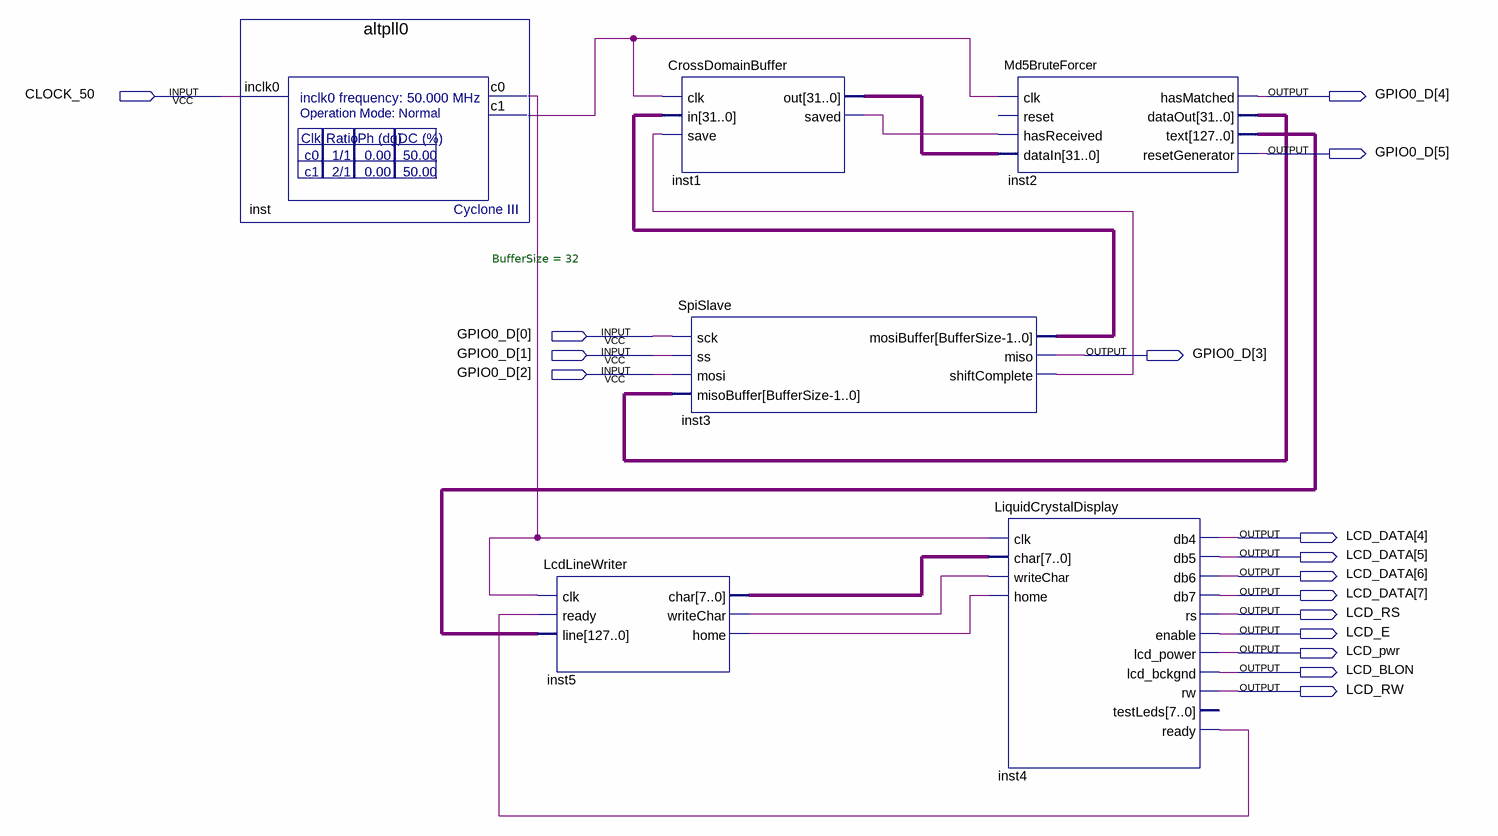
[diagram p0: schematic sheet]
// Quartus schematic DE0_fpga_md5.bdf as structural Verilog: 6 symbols, 16 pins
module DE0_fpga_md5 (
  input  CLOCK_50,
  inout  [5:0] GPIO0_D,
  output [7:4] LCD_DATA,
  output LCD_RS,
  output LCD_E,
  output LCD_pwr,
  output LCD_BLON,
  output LCD_RW
);

  wire inst1_saved, inst3_shiftcomplete, inst4_ready, inst5_home, inst5_writechar, inst_c0, inst_c1;
  wire [7:0] inst5_char;
  wire [31:0] inst1_out, inst2_dataout, inst3_mosibuffer;
  wire [127:0] inst2_text;

  altpll0 inst (.inclk0(CLOCK_50), .c0(inst_c0), .c1(inst_c1));
  LcdLineWriter inst5 (
    .clk(inst_c0), .ready(inst4_ready), .line(inst2_text), .char(inst5_char), .writeChar(inst5_writechar),
    .home(inst5_home));
  CrossDomainBuffer inst1 (
    .clk(inst_c1), .in(inst3_mosibuffer), .save(inst3_shiftcomplete), .out(inst1_out), .saved(inst1_saved));
  SpiSlave #(.BufferSize(32)) inst3 (
    .sck(GPIO0_D[0]), .ss(GPIO0_D[1]), .mosi(GPIO0_D[2]), .misoBuffer(inst2_dataout),
    .mosiBuffer(inst3_mosibuffer), .miso(GPIO0_D[3]), .shiftComplete(inst3_shiftcomplete));
  Md5BruteForcer inst2 (
    .clk(inst_c1), .hasReceived(inst1_saved), .dataIn(inst1_out), .hasMatched(GPIO0_D[4]),
    .dataOut(inst2_dataout), .text(inst2_text), .resetGenerator(GPIO0_D[5]));  // open: reset
  LiquidCrystalDisplay inst4 (
    .clk(inst_c0), .char(inst5_char), .writeChar(inst5_writechar), .home(inst5_home), .db4(LCD_DATA[4]),
    .db5(LCD_DATA[5]), .db6(LCD_DATA[6]), .db7(LCD_DATA[7]), .rs(LCD_RS), .enable(LCD_E),
    .lcd_power(LCD_pwr), .lcd_bckgnd(LCD_BLON), .rw(LCD_RW), .ready(inst4_ready));  // open: testLeds
endmodule
